# EAGLE design wr703n-display (EAGLE 7.2.0)
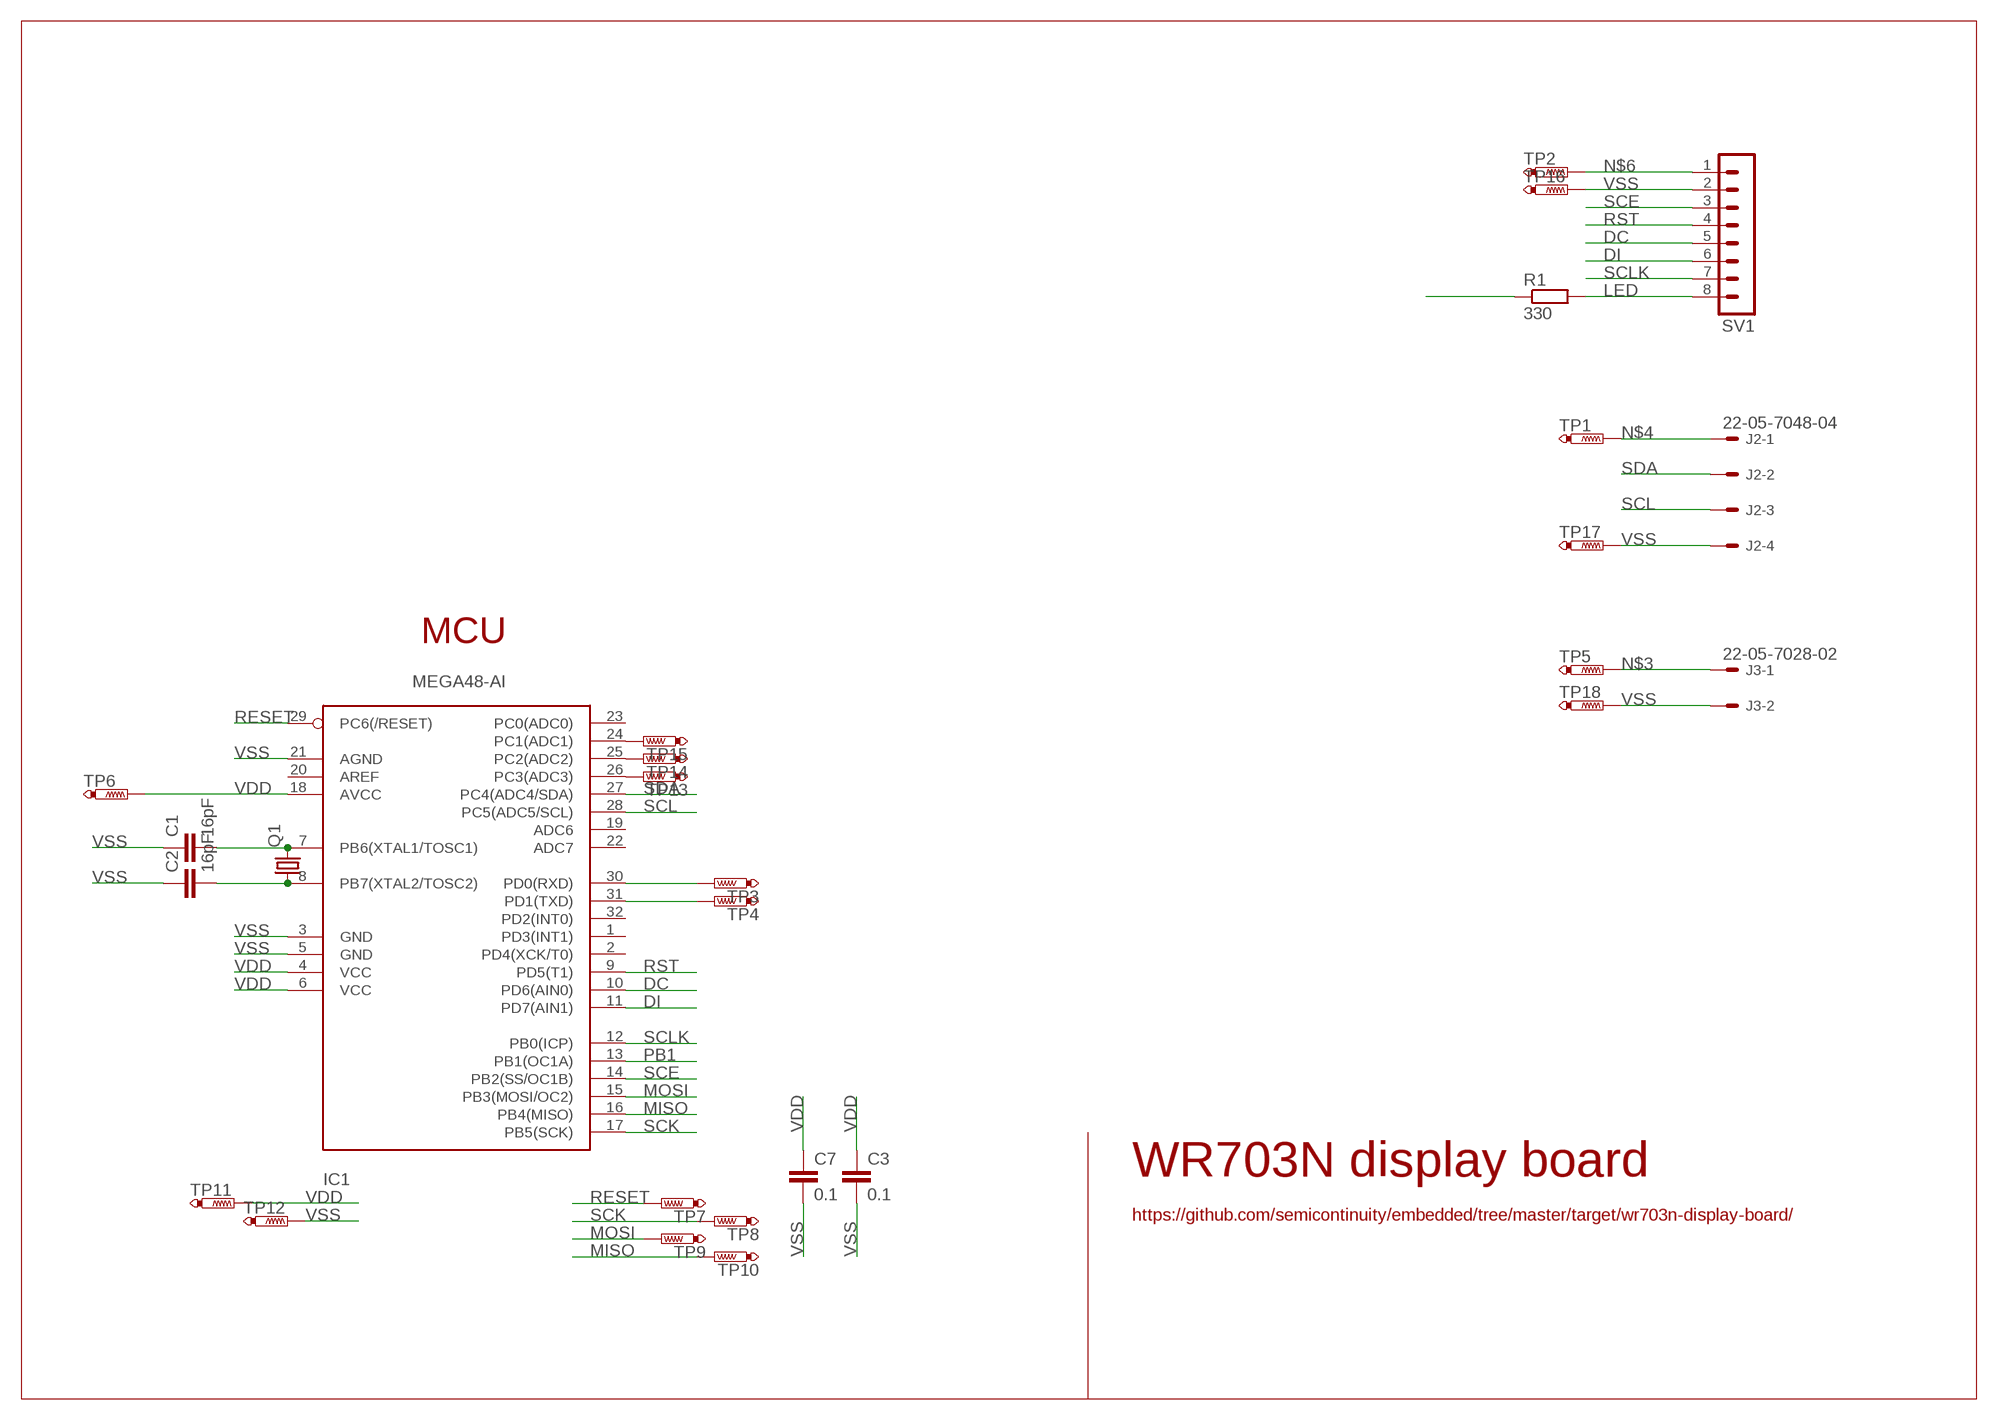
[diagram p0: schematic, sheet 1]

## Parts
C1  16pF  C-EUC0805  [C0805]
C2  16pF  C-EUC0805  [C0805]
C3  0.1  C-EUC0805  [C0805]
C7  0.1  C-EUC0805  [C0805]
IC1  MEGA48-AI  MEGA8-AI  [TQFP32-08]
J2  22-05-7048-04  [7395-04]
J3  22-05-7028-02  [7395-02]
Q1  CRYSTALHC49S  [HC49/S]
R1  330  R-EU_R0805  [R0805]
SV1  MA08-1  [MA08-1]
TP1  PTR1B2,54  [B2,54]
TP2  PTR1B2,54  [B2,54]
TP3  PTR1B2,54  [B2,54]
TP4  PTR1B2,54  [B2,54]
TP5  PTR1B2,54  [B2,54]
TP6  PTR1B2,54  [B2,54]
TP7  PTR1TP17R  [TP17R]
TP8  PTR1TP17R  [TP17R]
TP9  PTR1TP17R  [TP17R]
TP10  PTR1TP17R  [TP17R]
TP11  PTR1TP17R  [TP17R]
TP12  PTR1TP17R  [TP17R]
TP13  PTR1TP17R  [TP17R]
TP14  PTR1TP17R  [TP17R]
TP15  PTR1TP17R  [TP17R]
TP16  PTR1B2,54  [B2,54]
TP17  PTR1B2,54  [B2,54]
TP18  PTR1B2,54  [B2,54]

## Nets
DC: IC1.10(PD6(AIN0)) SV1.5
DI: IC1.11(PD7(AIN1)) SV1.6
LED: R1.2 SV1.8
MISO: IC1.16(PB4(MISO)) TP10.TP
MOSI: IC1.15(PB3(MOSI/OC2)) TP9.TP
N$1: C1.2 IC1.7(PB6(XTAL1/TOSC1)) Q1.2
N$2: C2.2 IC1.8(PB7(XTAL2/TOSC2)) Q1.1
N$3: J3.1 TP5.TP
N$4: J2.1 TP1.TP
N$5: IC1.31(PD1(TXD)) TP4.TP
N$6: SV1.1 TP2.TP
N$7: IC1.26(PC3(ADC3)) TP13.TP
N$8: IC1.25(PC2(ADC2)) TP14.TP
N$9: IC1.24(PC1(ADC1)) TP15.TP
PB1: IC1.13(PB1(OC1A)) R1.1
RESET: IC1.29(PC6(/RESET)) TP7.TP
RST: IC1.9(PD5(T1)) SV1.4
RX: IC1.30(PD0(RXD)) TP3.TP
SCE: IC1.14(PB2(SS/OC1B)) SV1.3
SCK: IC1.17(PB5(SCK)) TP8.TP
SCL: IC1.28(PC5(ADC5/SCL)) J2.3
SCLK: IC1.12(PB0(ICP)) SV1.7
SDA: IC1.27(PC4(ADC4/SDA)) J2.2
VDD: C3.1 C7.1 IC1.4(VCC) IC1.6(VCC) IC1.18(AVCC) TP6.TP TP11.TP
VSS: C1.1 C2.1 C3.2 C7.2 IC1.3(GND) IC1.5(GND) IC1.21(AGND) J2.4 J3.2 SV1.2 TP12.TP TP16.TP TP17.TP TP18.TP
Unconnected: IC1.1(PD3(INT1)) IC1.2(PD4(XCK/T0)) IC1.19(ADC6) IC1.20(AREF) IC1.22(ADC7) IC1.23(PC0(ADC0)) IC1.32(PD2(INT0))

## Notes on the sheet
- MCU
- WR703N display board
- https://github.com/semicontinuity/embedded/tree/master/target/wr703n-display-board/

## Library data of the parts
C1-C3 C7 = rcl:C-EU: CAPACITOR, European symbol
IC1 = my-atmel:MEGA8: MICROCONTROLLER 8 Kbytes FLASH 1 kbytes SRAM 512 bytes EEPROM USART 6-channel 10 bit ADC 2-channel 8 bit ADC
J2 = con-molex:22-?-04: CONNECTOR wire to board 2.54 mm (.1 inch) pitch header; OC_FARNELL: unknown; OC_NEWARK: unknown
J3 = con-molex:22-?-02: CONNECTOR wire to board 2.54 mm (.1 inch) pitch header; OC_FARNELL: 9731601; OC_NEWARK: unknown
Q1 = crystal:CRYSTAL: CRYSTAL; OC_FARNELL: 1667008; OC_NEWARK: unknown
R1 = rcl:R-EU_: RESISTOR, European symbol
SV1 = con-lstb:MA08-1: PIN HEADER; OC_FARNELL: unknown; OC_NEWARK: unknown
TP1-TP18 = testpad:PTR1: TEST PIN

## Board
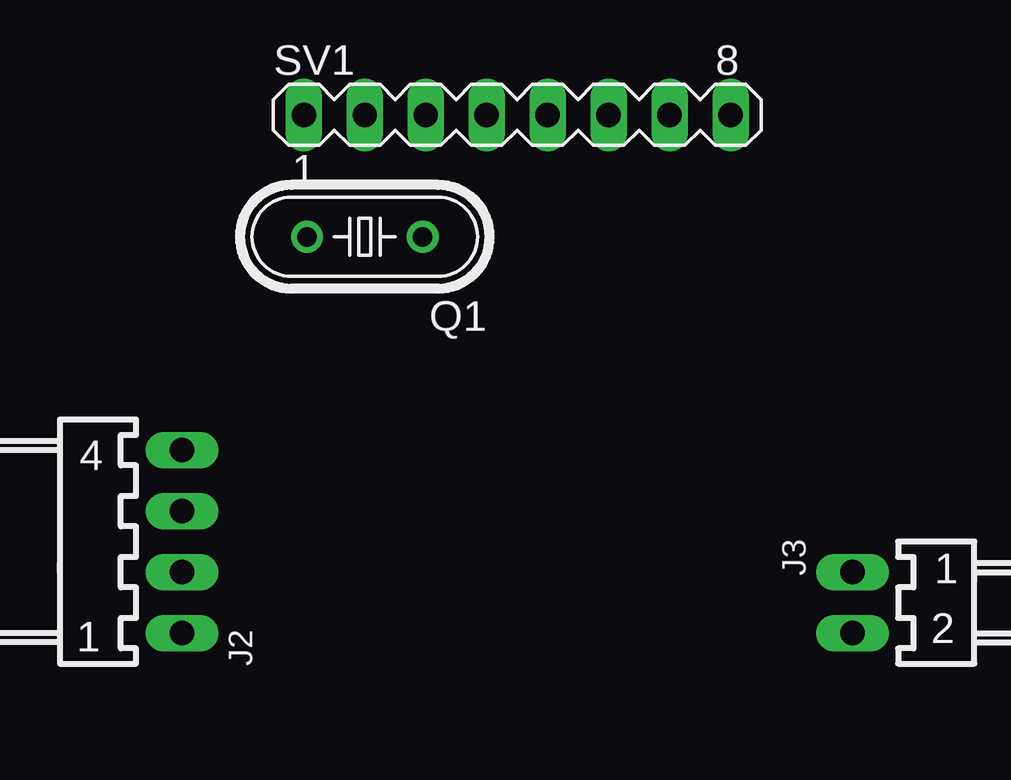
[diagram p1: board, top side]
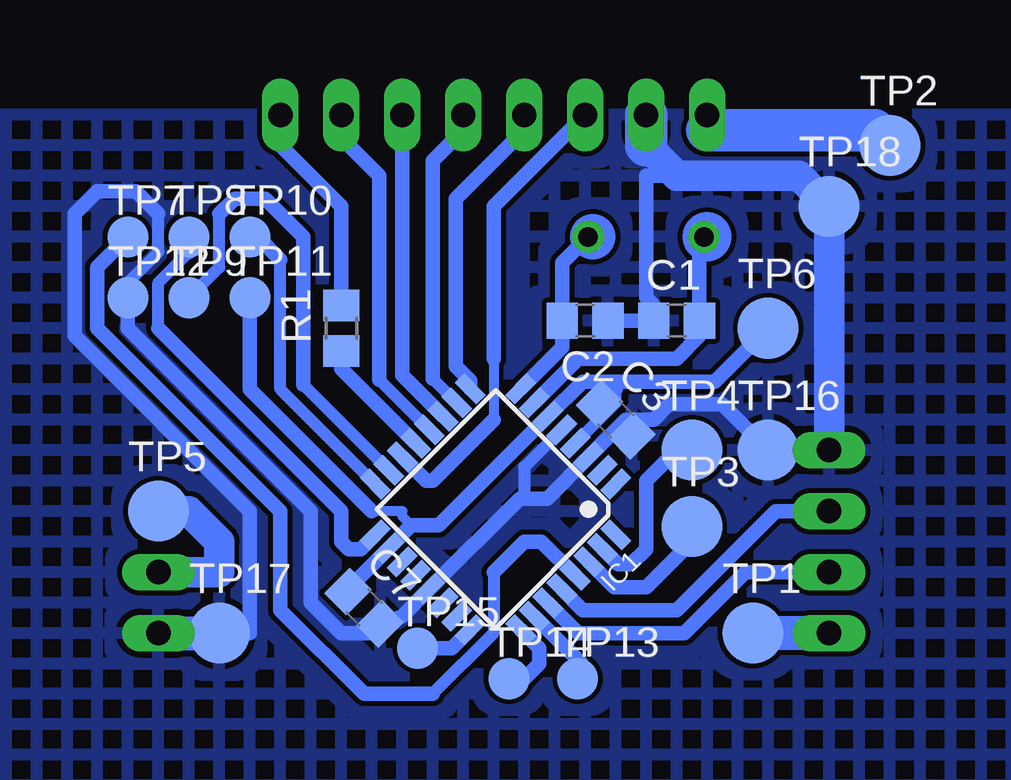
[diagram p2: board, bottom side, seen from below]

No outline drawn. Coordinates in mm, seen from the top.
Copper layers (1*16): Top 0.035mm / dielectric 1.5mm / Bottom 0.035mm
Design rules "default": minimum track width 10mil, minimum drill 24mil, track to track 8mil, track to pad 8mil, pad to pad 8mil, via to via 8mil, smd to smd 8mil, copper to edge 40mil, drill to drill 8mil, minimum pad ring 10mil, minimum via ring 8mil, stop-mask expansion 4mil, vias tented up to drill 0mil, thermal gap 10mil
tKeepout: area 17.8,7.6 to 30.5,19.1

### Footprints (pad centres in the part's own frame; a part is rotated, then mirrored left to right if it is on the bottom)
C0805 = smd 1.3 x 1.5: 1 -0.95,0; 2 0.95,0
TQFP32-08 = smd 1.27 x 0.559: 1 -4.293,2.8; 2 -4.293,2; 3 -4.293,1.2; 4 -4.293,0.4; 5 -4.293,-0.4; 6 -4.293,-1.2; 7 -4.293,-2; 8 -4.293,-2.8; 17 4.293,-2.8; 18 4.293,-2; 19 4.293,-1.2; 20 4.293,-0.4; 21 4.293,0.4; 22 4.293,1.2; 23 4.293,2; 24 4.293,2.8 | smd 0.559 x 1.27: 9 -2.8,-4.293; 10 -2,-4.293; 11 -1.2,-4.293; 12 -0.4,-4.293; 13 0.4,-4.293; 14 1.2,-4.293; 15 2,-4.293; 16 2.8,-4.293; 25 2.8,4.293; 26 2,4.293; 27 1.2,4.293; 28 0.4,4.293; 29 -0.4,4.293; 30 -1.2,4.293; 31 -2,4.293; 32 -2.8,4.293
7395-04 = drill 1.016 long: 1 3.81,0; 2 1.27,0; 3 -1.27,0; 4 -3.81,0
7395-02 = drill 1.016 long: 1 1.27,0; 2 -1.27,0
HC49/S = drill 0.813: 1 -2.413,0; 2 2.413,0
R0805 = smd 1.3 x 1.5: 1 -0.95,0; 2 0.95,0
MA08-1 = drill 1.016 long: 1 -8.89,0; 2 -6.35,0; 3 -3.81,0; 4 -1.27,0; 5 1.27,0; 6 3.81,0; 7 6.35,0; 8 8.89,0
B2,54 = smd 2.54 x 2.54: TP 0,0
TP17R = smd 1.7 x 1.7: TP 0,0

### Placement (x,y rotation side)
C1  15.24,38.42 0 bottom
C2  19.05,38.42 180 bottom
C3  17.78,34.29 315 bottom
C7  28.27,26.46 315 bottom
IC1  22.79,30.55 225 bottom
J2  8.89,29.21 270 top
J3  36.83,26.67 90 top
Q1  16.51,41.91 180 top
R1  29.21,38.1 90 bottom
SV1  22.86,46.99 0 top
TP1  12.06,25.4 0 bottom
TP2  6.35,45.72 0 bottom
TP3  14.61,29.84 0 bottom
TP4  14.61,33.02 0 bottom
TP5  36.83,30.48 0 bottom
TP6  11.43,38.1 0 bottom
TP7  38.1,41.91 0 bottom
TP8  35.56,41.91 0 bottom
TP9  35.56,39.37 0 bottom
TP10  33.02,41.91 0 bottom
TP11  33.02,39.37 0 bottom
TP12  38.1,39.37 0 bottom
TP13  19.37,23.5 0 bottom
TP14  22.23,23.5 0 bottom
TP15  26.04,24.77 0 bottom
TP16  11.43,33.02 0 bottom
TP17  34.29,25.4 0 bottom
TP18  8.89,43.18 0 bottom

### Tracks (layer width: path | path; a pad name or v marks a point on that pad's centre or on a via)
DC
  Bottom 0.508: IC1.10 25.4,36 | SV1.5 24.13,46.35
  Bottom 0.61: 24.13,46.35 25.4,45.09 25.4,36
DI
  Bottom 0.61: IC1.11 26.67,36.13 SV1.6
LED
  Bottom 0.61: R1.2 29.21,43.18 31.75,45.72 SV1.8
MISO
  Bottom 0.508: IC1.16 31.75,35.56 31.75,40.96
  Bottom 0.61: 31.75,40.96 32.7,41.91 TP10.TP
MOSI
  Bottom 0.508: IC1.15 30.8,35.74 | TP9.TP 34.29,40.64 34.29,42.86
  Bottom 0.61: 30.8,35.74 30.8,41.91 32.38,43.5 33.66,43.5 34.29,42.86
N$1
  Bottom 0.61: IC1.7 19.34,36.83 15.24,36.83 14.29,37.78 C1.2 14.29,41.72 Q1.2
N$2
  Bottom 0.61: Q1.1 20,40.83 C2.2 20,37.3 IC1.8
N$3
  Bottom 1.27: J3.1 34.29,27.94 34.29,29.21 35.56,30.48 TP5.TP
N$4
  Bottom 1.422: J2.1 TP1.TP
N$5
  Bottom 0.61: IC1.31 17.66,28.26 17.14,28.26 16.51,28.89 16.51,31.75 15.24,33.02 TP4.TP
N$6
  Bottom 1.422: SV1.1 13.97,46.35
  Bottom 1.778: 13.97,46.35 6.99,46.35 TP2.TP
N$7
  Bottom 0.61: IC1.26 19.19,24.13 19.37,24.13 TP13.TP
N$8
  Bottom 0.61: IC1.25 20.96,24.77 20.95,24.77 20.95,24.13 21.59,23.5 TP14.TP
N$9
  Bottom 0.61: IC1.24 24.61,24.77 TP15.TP
PB1
  Bottom 0.61: IC1.13 29.21,36.41 R1.1
RESET
  Bottom 0.508: 22.86,27.94 22.86,25.4 25.4,22.86
  Bottom 0.61: IC1.29 20.88,29.21 21.59,29.21 22.86,27.94 | TP7.TP 39.37,40.64 39.37,38.1 31.75,30.48 31.75,26.35 28.26,22.86 25.4,22.86
RST
  Bottom 0.508: SV1.4 21.59,46.35
  Bottom 0.61: IC1.9 23.84,35.91 24.45,36.51 24.45,43.5 21.59,46.35
RX
  Bottom 0.61: IC1.30 17.84,27.3 16.51,27.3 14.61,29.21 TP3.TP
SCE
  Bottom 0.406: 22.86,36.83 22.86,34.29
  Bottom 0.61: SV1.3 22.86,43.18 22.86,36.83 | 22.86,34.29 25.4,31.75 25.68,31.75 IC1.14
SCK
  Bottom 0.508: 35.56,41.27 36.83,40.01 36.83,38.1
  Bottom 0.61: IC1.17 28.41,28.89 28.89,28.89 29.21,29.21 29.21,30.48 36.83,38.1 | 35.56,41.27 TP8.TP
SCL
  Bottom 0.61: IC1.28 19.15,26.35 15.24,26.35 11.11,30.48 J2.3
SCLK
  Bottom 0.508: IC1.12 27.62,35.96
  Bottom 0.61: 27.62,35.96 27.62,44.45 29.21,46.04 SV1.7
SDA
  Bottom 0.61: IC1.27 19.33,25.4 14.92,25.4 12.38,27.94 J2.2
VDD
  Bottom 0.406: 26.29,29.88 26.67,30.26 26.67,30.48 27.94,30.48
  Bottom 0.508: IC1.4 17.78,34.99 17.78,35.56 17.78,35.88
  Bottom 0.61: C7.1 28.62,27.55 IC1.18 26.29,29.88 25.16,29.88 IC1.6 19.16,35.88 17.78,35.88 13.65,35.88 TP6.TP | 27.94,30.48 33.02,35.56 TP11.TP | C3.1 17.85,35.56 17.78,35.56
VSS
  Bottom 0.508: IC1.5 21.59,32.32 21.59,31 | TP12.TP 38.1,40.01 36.83,41.27 36.83,42.86
  Bottom 0.61: C2.1 C1.1 16.19,39.05 16.51,39.37 16.51,44.45 11.43,44.45 | 36.83,42.86 37.78,43.81 39.37,43.81 40.32,42.86 40.32,37.78 33.02,30.48 33.02,25.4 TP17.TP | 17.57,34.08 IC1.3 20.64,31 21.59,31 21.77,31 IC1.21 26.67,26.1 C7.2 27.98,25.4 29.21,25.4 30.48,26.67 30.48,30.48 38.1,38.1 TP12.TP | C3.2 17.57,34.08 | J2.4 TP16.TP 13.34,34.92 15.56,34.92 16.19,34.29 17.35,34.29 17.57,34.08 | 34.92,25.4 TP17.TP | J3.2 TP17.TP
  Bottom 1.27: 16.51,45.72 15.24,44.45 11.43,44.45 10.16,44.45 TP18.TP J2.4
  Bottom 1.422: J3.2 34.92,25.4
  Bottom 1.778: SV1.2 16.51,45.72
  pour Bottom (hatched): 0,46.99 45.72,46.99 45.72,19.05 0,19.05
(copper drawn outside any net)
  shapes: Bottom circle x2

### Text on the board
tOrigins: 52.5 | 0 | 10 | 20 | 30 | 22.5